# EAGLE design Ultra96toPMODV10 (EAGLE 9.6.2)
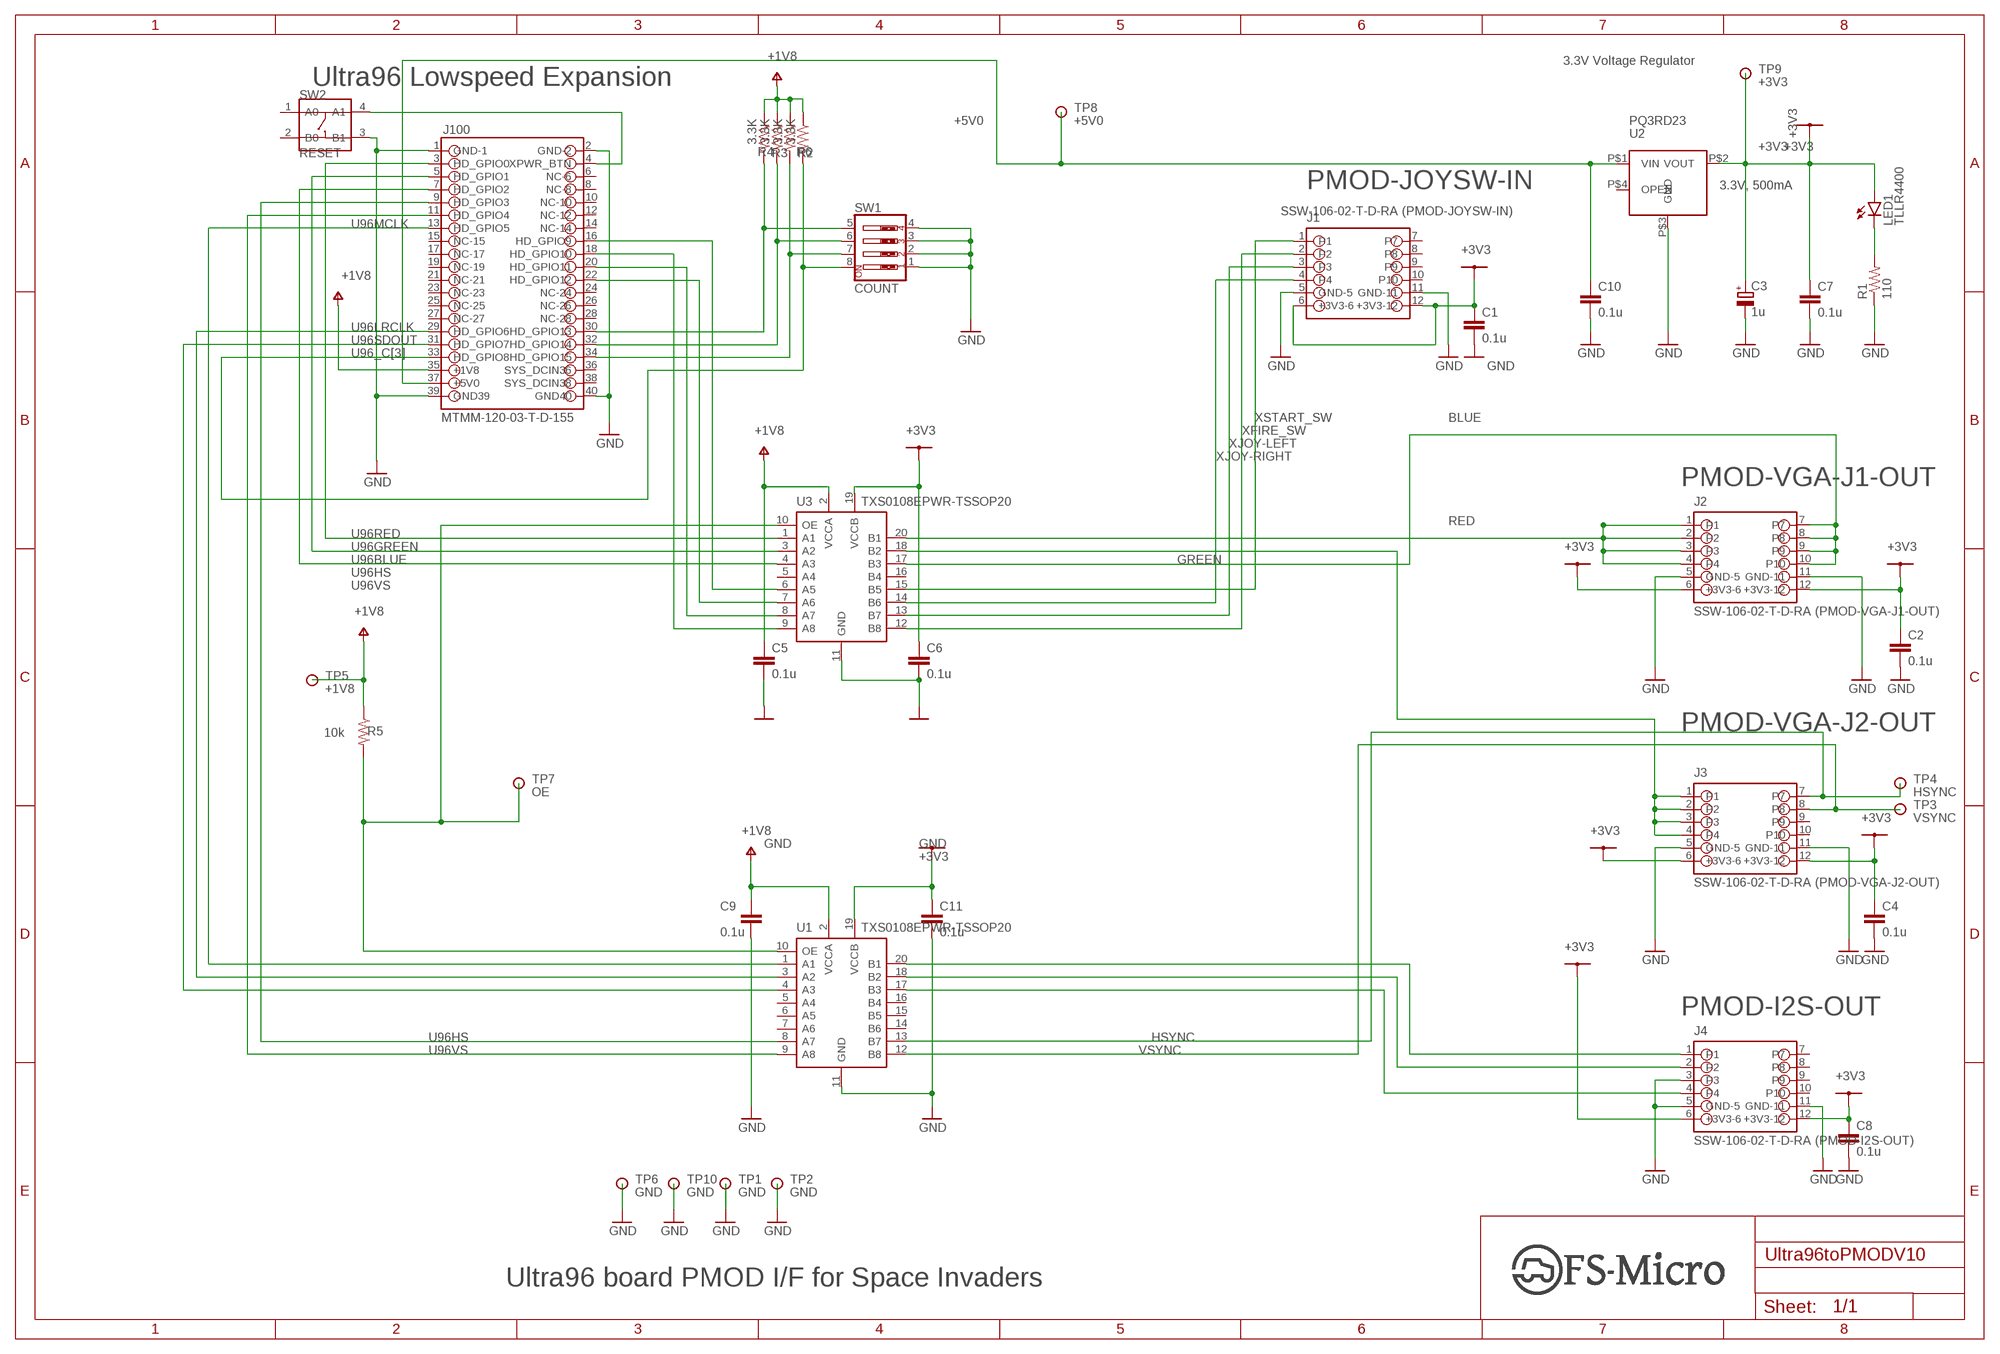
[diagram p0: schematic, sheet 1]

## Parts
C1  0.1u  C-EU050-025X075  [C050-025X075]
C2  0.1u  C-EU050-025X075  [C050-025X075]
C3  1u  CPOL-EUE2.5-5  [E2,5-5]
C4  0.1u  C-EU050-025X075  [C050-025X075]
C5  0.1u  C-EU050-025X075  [C050-025X075]
C6  0.1u  C-EU050-025X075  [C050-025X075]
C7  0.1u  C-EU050-025X075  [C050-025X075]
C8  0.1u  C-EU050-025X075  [C050-025X075]
C9  0.1u  C-EU050-025X075  [C050-025X075]
C10  0.1u  C-EU050-025X075  [C050-025X075]
C11  0.1u  C-EU050-025X075  [C050-025X075]
J1  SSW-106-02-T-D-RA (PMOD-JOYSW-IN)  SSW-106-02-T-D-RA  [SSW-106-02-T-D-RA]
J2  SSW-106-02-T-D-RA (PMOD-VGA-J1-OUT)  SSW-106-02-T-D-RA  [SSW-106-02-T-D-RA]
J3  SSW-106-02-T-D-RA (PMOD-VGA-J2-OUT)  SSW-106-02-T-D-RA  [SSW-106-02-T-D-RA]
J4  SSW-106-02-T-D-RA (PMOD-I2S-OUT)  SSW-106-02-T-D-RA  [SSW-106-02-T-D-RA]
J100  MTMM-120-03-T-D-155  [MTMM-120-03-T-D-155]
LED1  TLLR4400  [LED3MM]
R1  110  R-US_0207/10  [0207/10]
R2  3.3K  R-US_0207/10  [0207/10]
R3  3.3K  R-US_0207/10  [0207/10]
R4  3.3K  R-US_0207/10  [0207/10]
R5  10k  R-US_0207/10  [0207/10]
R6  3.3K  R-US_0207/10  [0207/10]
SW1  COUNT  SW_DIP-4  [EDG-04]
SW2  RESET  DIP-SWITCH-TACTILE-SPST-NO/TS-1109(4P-D6.0MM)'TS-1109'  [SW4-6.0X6.0X5.0MM]
TP1  GND  TP  [TP]
TP2  GND  TP  [TP]
TP3  VSYNC  TP  [TP]
TP4  HSYNC  TP  [TP]
TP5  +1V8  TP  [TP]
TP6  GND  TP  [TP]
TP7  OE  TP  [TP]
TP8  +5V0  TP  [TP]
TP9  +3V3  TP  [TP]
TP10  GND  TP  [TP]
U1  TXS0108EPWR-TSSOP20  LOGIC-TXS0108EPWR(TSSOP20)  [TSSOP20-0.65-6.5X4.4MM]
U2  PQ3RD23  [PQ3RD23]
U3  TXS0108EPWR-TSSOP20  LOGIC-TXS0108EPWR(TSSOP20)  [TSSOP20-0.65-6.5X4.4MM]

## Nets
+1V8 [+1V8]: C5.1 C9.1 J100.35(+1V8) R2.1 R3.1 R4.1 R5.1 R6.1 TP5.P$1 U1.2(VCCA) U3.2(VCCA)
+3V3 [+3V3]: C1.1 C2.1 C3.+ C4.1 C6.1 C7.1 C8.1 C11.1 J1.6(+3V3-6) J1.12(+3V3-12) J2.6(+3V3-6) J2.12(+3V3-12) J3.6(+3V3-6) J3.12(+3V3-12) J4.6(+3V3-6) J4.12(+3V3-12) LED1.A TP9.P$1 U1.19(VCCB) U2.P$2(VOUT) U3.19(VCCB)
+5V0 [+5V0]: C10.1 J100.37(+5V0) TP8.P$1 U2.P$1(VIN)
BLUE: J2.7 J2.8 J2.9 J2.10 U3.17(B3)
GND [GND]: C1.2 C2.2 C3.- C4.2 C5.2 C6.2 C7.2 C8.2 C9.2 C10.2 C11.2 J1.5(GND-5) J1.11(GND-11) J2.5(GND-5) J2.11(GND-11) J3.5(GND-5) J3.11(GND-11) J4.3 J4.5(GND-5) J4.11(GND-11) J100.1(GND-1) J100.2(GND-2) J100.39(GND39) J100.40(GND40) R1.1 SW1.1 SW1.2 SW1.3 SW1.4 SW2.3(B1) TP1.P$1 TP2.P$1 TP6.P$1 TP10.P$1 U1.11(GND) U2.P$3(GND) U3.11(GND)
GREEN: J3.1 J3.2 J3.3 J3.4 U3.18(B2)
HSYNC: J3.7 TP4.P$1 U1.13(B7)
LRCLK: J4.2 U1.18(B2)
MCLK: J4.1 U1.20(B1)
N$1: LED1.K(C) R1.2
OE: R5.2 TP7.P$1 U1.10(OE) U3.10(OE)
RED: J2.1 J2.2 J2.3 J2.4 U3.20(B1)
SDOUT: J4.4 U1.17(B3)
U96_C[0]: J100.30(HD_GPIO13) R4.2 SW1.5
U96_C[1]: J100.32(HD_GPIO14) R3.2 SW1.6
U96_C[2]: J100.34(HD_GPIO15) R2.2 SW1.7
U96_C[3]: J100.33(HD_GPIO8) R6.2 SW1.8
U96_FIRE: J100.18(HD_GPIO10) U3.9(A8)
U96_LEFT: J100.20(HD_GPIO11) U3.8(A7)
U96_RIGHT: J100.22(HD_GPIO12) U3.7(A6)
U96_START: J100.16(HD_GPIO9) U3.6(A5)
U96BLUE: J100.7(HD_GPIO2) U3.4(A3)
U96GREEN: J100.5(HD_GPIO1) U3.3(A2)
U96HS: J100.9(HD_GPIO3) U1.8(A7)
U96LRCLK: J100.29(HD_GPIO6) U1.3(A2)
U96MCLK: J100.13(HD_GPIO5) U1.1(A1)
U96RED: J100.3(HD_GPIO0) U3.1(A1)
U96SDOUT: J100.31(HD_GPIO7) U1.4(A3)
U96VS: J100.11(HD_GPIO4) U1.9(A8)
VSYNC: J3.8 TP3.P$1 U1.12(B8)
XFIRE_SW: J1.2 U3.12(B8)
XJOY-LEFT: J1.3 U3.13(B7)
XJOY-RIGHT: J1.4 U3.14(B6)
XPWR_BTN: J100.4(XPWR_BTN) SW2.4(A1)
XSTART_SW: J1.1 U3.15(B5)
Unconnected: J1.7 J1.8 J1.9 J1.10 J3.9 J3.10 J4.7 J4.8 J4.9 J4.10 J100.6(NC-6) J100.8(NC-8) J100.10(NC-10) J100.12(NC-12) J100.14(NC-14) J100.15(NC-15) J100.17(NC-17) J100.19(NC-19) J100.21(NC-21) J100.23(NC-23) J100.24(NC-24) J100.25(NC-25) J100.26(NC-26) J100.27(NC-27) J100.28(NC-28) J100.36(SYS_DCIN36) J100.38(SYS_DCIN38) SW2.1(A0) SW2.2(B0) U1.5(A4) U1.6(A5) U1.7(A6) U1.14(B6) U1.15(B5) U1.16(B4) U2.P$4(OPEN) U3.5(A4) U3.16(B4)

## Notes on the sheet
- 3.3V Voltage Regulator
- Ultra96 Lowspeed Expansion
- PMOD-JOYSW-IN | 3.3V, 500mA
- PMOD-VGA-J1-OUT
- PMOD-VGA-J2-OUT
- PMOD-I2S-OUT
- Ultra96 board PMOD I/F for Space Invaders

## Library data of the parts
C1 C2 C4-C11 = rcl:C-EU: CAPACITOR, European symbol; SPICEPREFIX: C
C3 = rcl:CPOL-EU: POLARIZED CAPACITOR, European symbol; SPICEPREFIX: C
J1-J4 = mylib:SSW-106-02-T-D-RA; VALUES: >VALUE
J100 = mylib:MTMM-120-03-T-D-155
LED1 = led:TLLR4400: Low Current (2mA) LED 3 mm Tinted Diffused Package color RED Source: Data sheet <http://www.farnell.com/datasheets/391100.pdf>; MF: VISHAY SEMICONDUCTOR; OC_FARNELL: 1612437
R1-R6 = rcl:R-US_: RESISTOR, American symbol; SPICEPREFIX: R
SW1 = special:SW_DIP-4: DIP SWITCH
SW2 = Seeed-Switch:DIP-SWITCH-TACTILE-SPST-NO/TS-1109(4P-D6.0MM): 311020024
TP1-TP10 = mylib:TP
U1 U3 = Seeed-IC:LOGIC-TXS0108EPWR(TSSOP20): 310050026; MPN: TXS0108EPWR
U2 = mylib:PQ3RD23

## Net classes
0 default: width 0.152 mm, drill 0.254 mm, clearance 0.152 mm
1 GND: width 0.508 mm, drill 0.254 mm, clearance 0.152 mm
2 +5V0: width 0.508 mm, drill 0.254 mm, clearance 0.152 mm
3 +3V3: width 0.508 mm, drill 0.254 mm, clearance 0.152 mm
4 +1V8: width 0.508 mm, drill 0.254 mm, clearance 0.152 mm

## Board
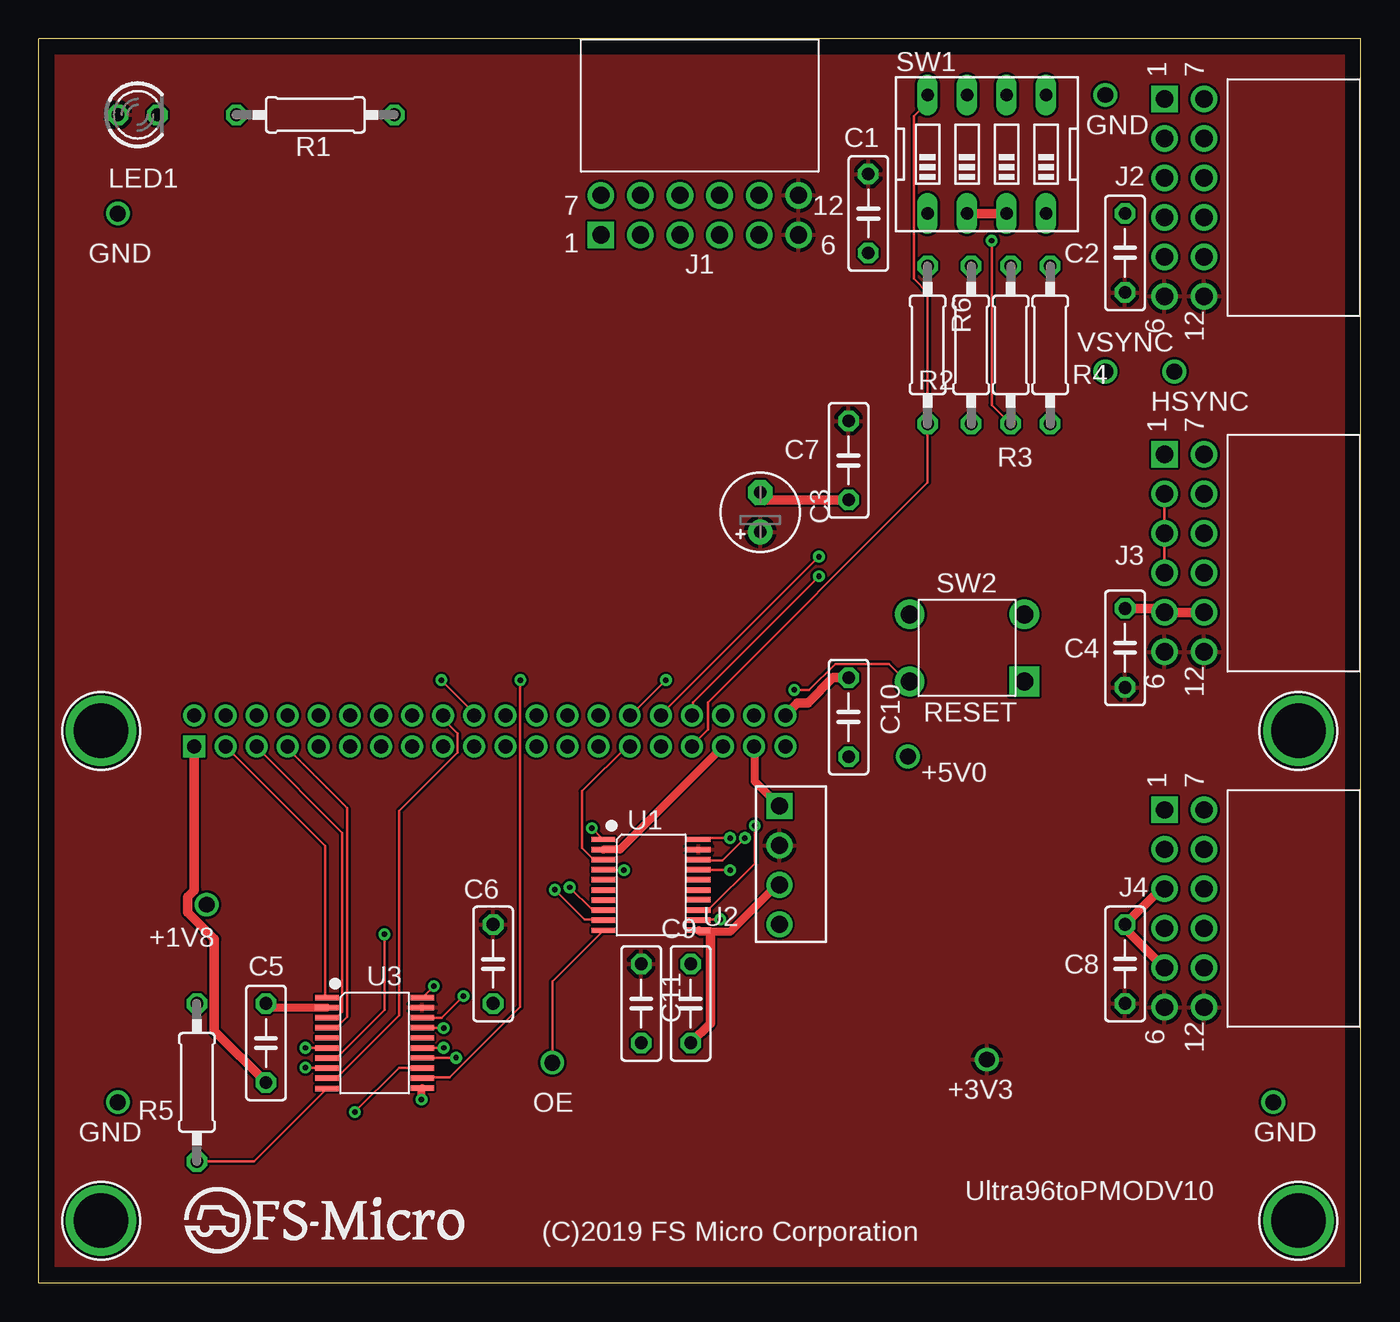
[diagram p1: board, top side]
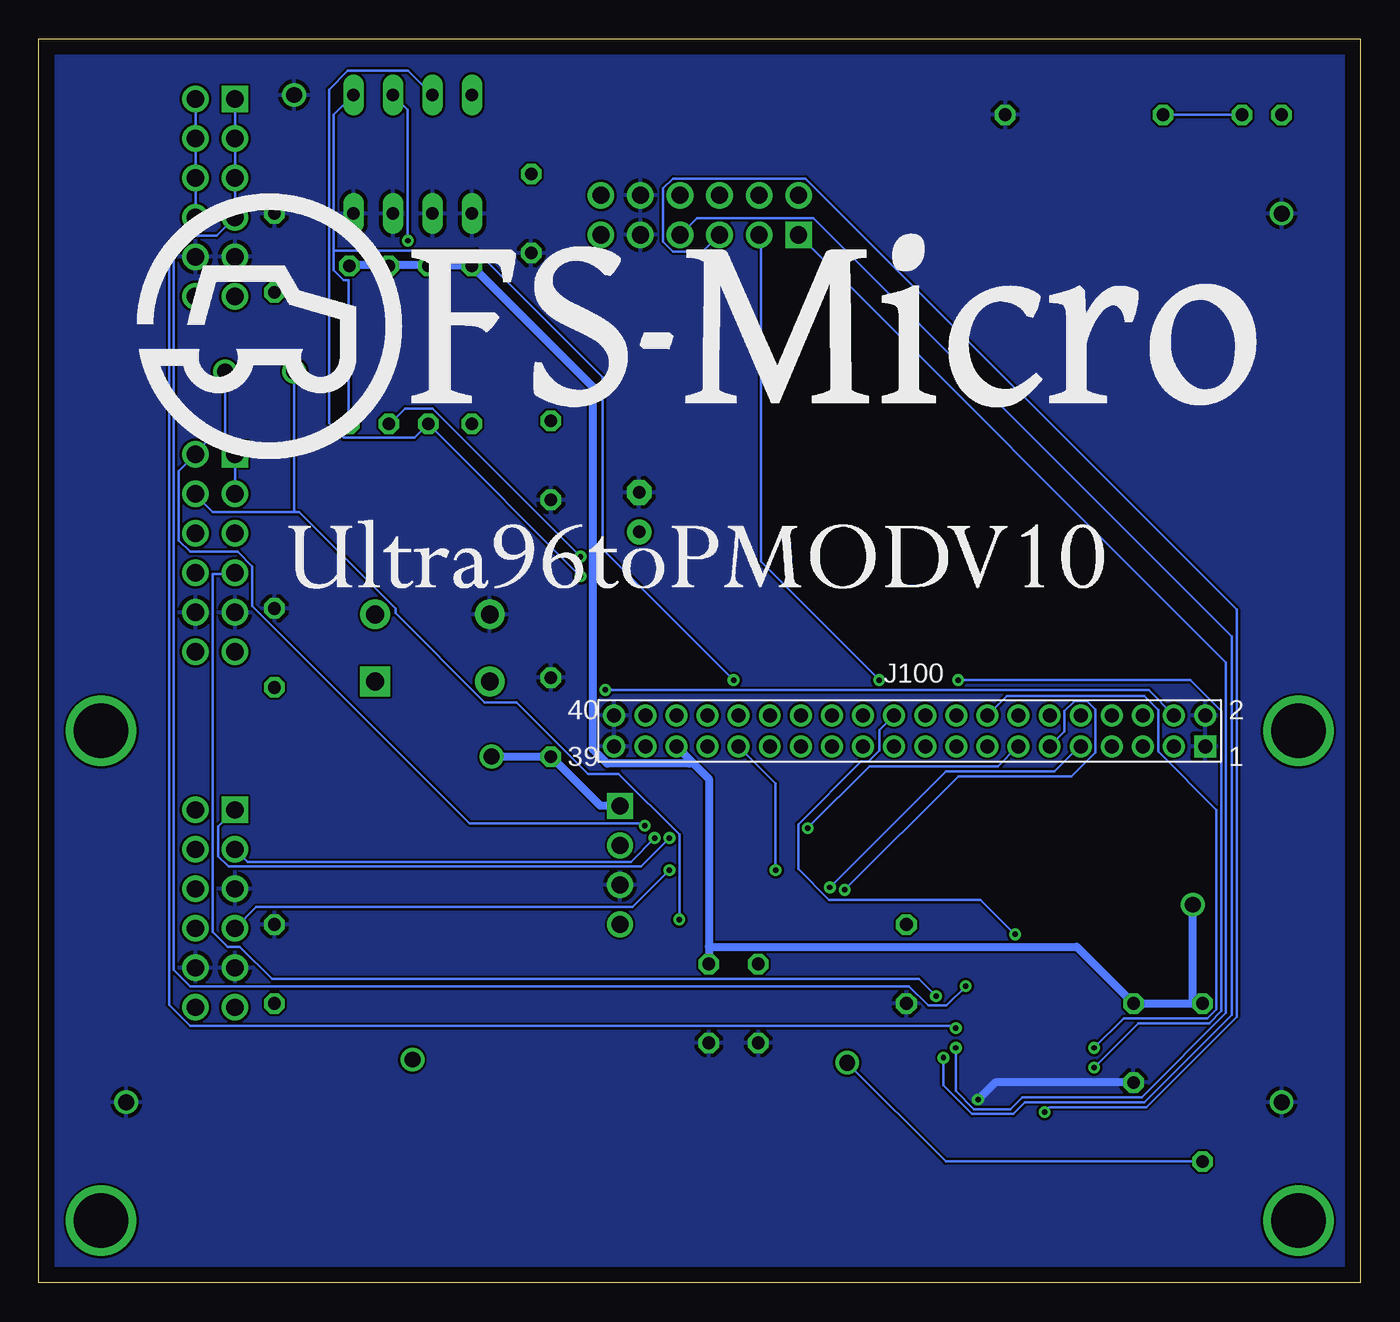
[diagram p2: board, bottom side, seen from below]

Size 85 x 80 mm. Coordinates in mm from the lower left corner, seen from the top.
Outline: 85,0 85,80 0,80 0,0 85,0
Copper layers (1+16): Top 0.035mm / dielectric 0.2mm / Bottom 0.035mm
Design rules "default *": minimum track width 6mil, minimum drill 0.35mm, track to track 6mil, track to pad 6mil, pad to pad 6mil, via to via 6mil, smd to smd 6mil, copper to edge 40mil, drill to drill 6mil, minimum pad ring 10mil, minimum via ring 8mil, stop-mask expansion 4mil, vias tented up to drill 0mil, thermal gap 10mil

### Footprints (pad centres in the part's own frame; a part is rotated, then mirrored left to right if it is on the bottom)
C050-025X075 = drill 0.813 octagon: 1 -2.54,0; 2 2.54,0
E2,5-5 = drill 0.813 pad 1.6: + -1.27,0 | drill 0.813 pad 1.6 octagon: - 1.27,0
SSW-106-02-T-D-RA = drill 1.105 pad 1.705 square: 1 6.35,1.27 | drill 1.105 pad 1.705: 2 3.81,1.27; 3 1.27,1.27; 4 -1.27,1.27; 5 -3.81,1.27; 6 -6.35,1.27; 7 6.35,-1.27; 8 3.81,-1.27; 9 1.27,-1.27; 10 -1.27,-1.27; 11 -3.81,-1.27; 12 -6.35,-1.27
MTMM-120-03-T-D-155 = drill 0.9 square: 1 -19,1 | drill 0.9: 2 -19,-1; 3 -17,1; 4 -17,-1; 5 -15,1; 6 -15,-1; 7 -13,1; 8 -13,-1; 9 -11,1; 10 -11,-1; 11 -9,1; 12 -9,-1; 13 -7,1; 14 -7,-1; 15 -5,1; 16 -5,-1; 17 -3,1; 18 -3,-1; 19 -1,1; 20 -1,-1; 21 1,1; 22 1,-1; 23 3,1; 24 3,-1; 25 5,1; 26 5,-1; 27 7,1; 28 7,-1; 29 9,1; 30 9,-1; 31 11,1; 32 11,-1; 33 13,1; 34 13,-1; 35 15,1; 36 15,-1; 37 17,1; 38 17,-1; 39 19,1; 40 19,-1
LED3MM = drill 0.813 octagon: A -1.27,0; K 1.27,0
0207/10 = drill 0.813 octagon: 1 -5.08,0; 2 5.08,0
EDG-04 = drill 0.813 long: 1 -3.81,-3.81; 2 -1.27,-3.81; 3 1.27,-3.81; 4 3.81,-3.81; 5 3.81,3.81; 6 1.27,3.81; 7 -1.27,3.81; 8 -3.81,3.81
SW4-6.0X6.0X5.0MM = drill 1.143 pad 1.905 square: 1 -3.683,2.159 | drill 1.143 pad 1.905: 2 -3.683,-2.159; 3 3.683,-2.159; 4 3.683,2.159
TP = drill 1.02: P$1 0,0
TSSOP20-0.65-6.5X4.4MM = smd 0.35 x 1.5: 1 -2.925,-3.065; 2 -2.275,-3.065; 3 -1.625,-3.065; 4 -0.975,-3.065; 5 -0.325,-3.065; 6 0.325,-3.065; 7 0.975,-3.065; 8 1.625,-3.065; 9 2.275,-3.065; 10 2.925,-3.065; 11 2.91,3.065; 12 2.26,3.065; 13 1.61,3.065; 14 0.96,3.065; 15 0.325,3.065; 16 -0.325,3.065; 17 -0.975,3.065; 18 -1.625,3.065; 19 -2.275,3.065; 20 -2.925,3.065
PQ3RD23 = drill 1.1 square: P$1 0,0 | drill 1.1: P$2 2.54,0; P$3 5.08,0; P$4 7.62,0

### Placement (x,y rotation side)
C1  53.34,68.77 270 top
C2  69.85,66.23 90 top
C3  46.39,49.56 90 top
C4  69.85,40.83 90 top
C5  14.61,15.43 270 top
C6  29.21,20.51 270 top
C7  52.07,52.9 270 top
C8  69.85,20.51 90 top
C9  41.91,17.97 270 top
C10  52.07,36.38 90 top
C11  38.73,17.97 270 top
J1  42.5,68.67 180 top
J2  73.66,69.79 90 top
J3  73.66,46.93 90 top
J4  73.66,24.07 90 top
J100  29,35.5 180 bottom
LED1  6.35,75.12 0 top
R1  17.78,75.12 180 top
R2  59.96,60.32 270 top
R3  62.5,60.32 270 top
R4  65.04,60.32 270 top
R5  10.16,12.89 270 top
R6  57.15,60.32 270 top
SW1  60.96,72.58 0 top
SW2  59.69,40.83 180 top
TP1  5.08,68.77 0 top
TP2  68.58,76.39 0 top
TP3  68.58,58.61 0 top
TP4  73.03,58.61 0 top
TP5  10.79,24.32 0 top
TP6  5.08,11.62 0 top
TP7  33.02,14.16 0 top
TP8  55.88,33.84 0 top
TP9  60.97,14.36 0 top
TP10  79.38,11.62 0 top
U1  39.37,25.59 270 top
U2  47.62,30.67 270 top
U3  21.59,15.43 270 top
U$1  [REVERSELOGO]  6.68,53.01 0 top
U$2  [REVERSE_V10]  16.51,44.64 0 top
U$3  [SMALL-LOGO]  9.36,1.9 0 top

### Tracks (layer width: path | path; a pad name or v marks a point on that pad's centre or on a via)
+1V8
  Top 0.508: U1.2 37.37,27.86 J100.35 | C5.1 14.87,17.7 U3.2
  Bottom 0.508: TP5.P$1 10.79,18.13 R5.1 C5.1 18.26,21.62 41.91,21.62 | R4.1 64.93,65.44 62.71,65.44 R3.1 62.39,65.44 60.17,65.44 R2.1 59.85,65.44 57.15,65.44 R6.1 49.37,57.62 49.37,34.3 48.46,33.39 43.16,33.39 43.02,33.53 | 41.91,21.62 C9.1 | 43.02,33.53 43.97,34.48 J100.35 | 41.91,21.62 41.91,32.42 43.02,33.53
+3V3
  pour Top: 0,80.2 0,0.19 85.09,0.19 85.09,80.2
+5V0
  Top 0.508: U2.P$1 46.04,32.26 46.04,34.46 J100.37
  Bottom 0.508: TP8.P$1 C10.1 48.9,30.67 U2.P$1
BLUE  (via drill 0.35)
  Top 0.152: v26.04,16.38 24.77,16.38 U3.17
  Bottom 0.152: J2.7 J2.8 J2.9 J2.10 76.62,66.83 76.62,17.88 75.28,16.54 26.19,16.54 v26.04,16.38
GND  (via drill 0.35)
  Top 0.508: v24.61,11.78 24.61,12.41 U3.11 | U2.P$3 47.47,25.59 44.45,22.57 43.18,22.57 42.55,22.57 U1.11
  Top 0.61: C9.2 43.18,16.7 43.18,22.57 | J100.40 48.8,37.3 49.45,37.3 51.08,38.92 C10.2 | J100.1 10,25.25 9.57,24.83 9.57,23.81 11.28,22.11 11.28,16.22 C5.2 | SW1.3 SW1.2 | J4.5 69.85,22.8 C8.2 72.14,25.34 J4.3 | J3.11 J3.5 72.14,43.37 C4.2 | C7.2 46.87,50.35 C3.-
  Bottom 0.508: v24.61,11.78 23.5,12.89 C5.2
  pour Bottom: 0,80.2 0,0.19 85.09,0.19 85.09,80.2
GREEN  (via drill 0.35)
  Top 0.152: J3.2 J3.3 J3.4 | v27.3,18.45 25.91,17.05 U3.18
  Bottom 0.152: J3.2 J3.1 | v27.3,18.45 28.42,19.56 70.01,19.56 72.07,21.62 72.87,21.62 73.82,22.57 73.82,45.59 72.39,45.59 J3.4
HSYNC  (via drill 0.35)
  Top 0.152: U1.13 42.46,24 43.06,24 46.04,26.98 v46.04,29.4
  Bottom 0.152: v46.04,29.4 46.2,29.56 57.3,29.56 71.28,43.54 71.28,46.08 72.22,47.02 75.28,47.02 76.01,47.75 76.01,52.2 J3.7 74.93,53.37 73.82,54.48 73.03,54.48 TP4.P$1
LRCLK  (via drill 0.35)
  Top 0.152: v45.4,28.61 43.97,27.18 42.55,27.18 U1.18
  Bottom 0.152: J4.2 71.59,27.08 46.93,27.08 v45.4,28.61
MCLK  (via drill 0.35)
  Top 0.152: v44.45,28.61 42.55,28.61 U1.20
  Bottom 0.152: J4.1 73.47,29.34 73.47,27.43 72.81,26.77 46.28,26.77 v44.45,28.61
N$1
  Bottom 0.152: R1.2 LED1.K
N$23  (via drill 3.5 pad 4)
  other vias: 4,4
N$26  (via drill 3.5 pad 4)
  other vias: 81,4
N$27  (via drill 3.5 pad 4)
  other vias: 4,35.5
N$28  (via drill 3.5 pad 4)
  other vias: 81,35.5
OE
  Top 0.152: R5.2 13.83,7.81 U3.10 | TP7.P$1 33.02,19.38 U1.10
  Bottom 0.152: TP7.P$1 26.67,7.81 R5.2
RED  (via drill 0.35)
  Top 0.152: v25.4,19.08 24.77,18.45 U3.20
  Bottom 0.152: J2.1 J2.2 J2.3 J2.4 73.57,67.34 75.1,67.34 76.32,66.12 76.32,20.12 75.28,19.08 29.05,19.08 27.81,17.84 26.64,17.84 v25.4,19.08
SDOUT  (via drill 0.35)
  Top 0.152: v44.45,26.54 42.55,26.54 U1.17
  Bottom 0.152: v44.45,26.54 46.83,24.16 71.03,24.16 J4.4
U96_C[0]  (via drill 0.35)
  Top 0.152: v40.32,38.77 38.1,36.54 J100.30
  Bottom 0.152: 66.04,66.39 66.04,65.12 65.41,64.48 65.09,64.48 65.09,55.28 R4.2 | v40.32,38.77 48.74,47.18 48.74,58.24 56.88,66.39 66.04,66.39 | SW1.5 66.04,75.12 66.04,66.39
U96_C[1]  (via drill 0.35)
  Top 0.152: v50.16,46.7 40,36.54 J100.32 | v61.28,67.02 61.28,56.46 R3.2
  Bottom 0.152: v50.16,46.7 59.69,56.23 61.44,56.23 62.39,55.28 R3.2 | SW1.6 61.28,75.44 v61.28,67.02
U96_C[2]  (via drill 0.35)
  Top 0.152: v50.16,45.43 42.07,37.34 42.07,36.57 J100.34
  Bottom 0.152: v50.16,45.43 59.85,55.12 R2.2 60.85,54.35 65.41,54.35 66.34,55.29 66.34,76.73 65.14,77.94 61.24,77.94 SW1.7
U96_C[3]
  Top 0.152: SW1.8 57.15,75.91 56.26,75.03 56.26,64.58 57.15,63.69 R6.2 57.15,51.47 43.02,37.34 43.02,35.59 42,34.57 J100.33
U96_FIRE
  Top 0.152: J100.18 26,36.26 26.93,35.33 26.93,34.11 23.18,30.35 23.18,17.21 19.18,13.21 18.58,13.21 U3.9
U96_LEFT  (via drill 0.35)
  Top 0.152: v17.14,13.84 18.41,13.84 U3.8 | v25.88,38.77 28.1,36.54 J100.20
  Bottom 0.152: v17.14,13.84 14.29,16.7 9.74,16.7 8.97,17.48 8.97,36.78 10.95,38.77 v25.88,38.77
U96_RIGHT  (via drill 0.35)
  Top 0.152: U3.7 18.55,14.48 19.15,14.48 22.23,17.56 v22.23,22.41
  Bottom 0.152: v22.23,22.41 24.45,24.64 34.2,24.64 36.17,26.61 36.17,29.49 32.13,33.53 31.65,33.53 30.96,34.23 30.96,35.54 J100.22
U96_START  (via drill 0.35)
  Top 0.152: v17.14,15.11 18.41,15.11 U3.6
  Bottom 0.152: v17.14,15.11 15.24,17.02 9.86,17.02 9.27,17.6 9.27,30.42 13.02,34.16 13.02,36.84 13.92,37.74 22.76,37.74 J100.16
U96BLUE
  Top 0.152: J100.7 16,34.36 19.81,30.55 19.81,17.09 19.26,16.54 18.66,16.54 U3.4
U96GREEN
  Top 0.152: J100.5 14,34.45 19.5,28.95 19.5,17.44 19.12,17.05 U3.3
U96HS  (via drill 0.35)
  Top 0.152: v34.13,25.43 35.56,24 36.2,24 U1.8
  Bottom 0.152: v34.13,25.43 26.67,32.89 19.68,32.89 18.08,34.5 J100.9
U96LRCLK
  Top 0.152: U1.3 36.2,27.18 35.72,27.18 34.92,27.97 34.92,31.62 37.94,34.64 J100.29
U96MCLK  (via drill 0.35)
  Top 0.152: v35.56,29.24 36.2,28.61 U1.1
  Bottom 0.152: v35.56,29.24 31.59,33.21 23.34,33.21 22.07,34.48 J100.13
U96RED
  Top 0.152: U3.1 18.41,18.46 18.41,28.09 J100.3
U96SDOUT  (via drill 0.35)
  Top 0.152: v37.62,26.54 36.35,26.54 U1.4
  Bottom 0.152: J100.31 37.62,32.12 v37.62,26.54
U96VS  (via drill 0.35)
  Top 0.152: v33.18,25.27 35.08,23.37 36.2,23.37 U1.9
  Bottom 0.152: v33.18,25.27 25.88,32.58 18.61,32.58 17.07,34.11 17.07,36.89 17.61,37.43 18.39,37.43 19.05,36.77 19.05,35.45 J100.11
VSYNC  (via drill 0.35)
  Top 0.152: v43.81,23.37 42.55,23.37 U1.12
  Bottom 0.152: 68.58,49.56 73.82,49.56 74.93,50.67 J3.8 | 68.58,49.56 TP3.P$1 | 68.58,49.56 68.28,49.56 62.07,43.36 62.07,43.06 56.34,37.34 54.29,37.34 49.69,32.73 47.72,32.73 43.81,28.83 v43.81,23.37
XFIRE_SW  (via drill 0.35)
  Top 0.152: U3.12 24.69,13.21 26.42,13.21 30.96,17.75 v30.96,38.77
  Bottom 0.152: v30.96,38.77 38.58,46.39 38.58,67.28 J1.2
XJOY-LEFT  (via drill 0.35)
  Top 0.152: v20.32,10.98 23.16,13.82 U3.13
  Bottom 0.152: v20.32,10.98 20,11.3 13.79,11.3 7.98,17.12 7.98,43.29 35.7,71.02 44.22,71.02 44.85,70.39 44.85,66.95 44.22,66.32 42.31,66.32 J1.3
XJOY-RIGHT  (via drill 0.35)
  Top 0.152: v26.83,14.48 24.77,14.48 U3.14
  Bottom 0.152: J1.4 43.76,67.4 42.68,68.48 35.2,68.48 8.28,41.56 8.28,17.24 13.9,11.62 21.59,11.62 22.34,10.87 24.98,10.87 26.83,12.71 v26.83,14.48
XPWR_BTN  (via drill 0.35)
  Top 0.152: v48.58,38.13 49.53,38.13 51.21,39.81 54.67,39.81 55.82,38.67 SW2.4
  Bottom 0.152: v48.58,38.13 13.63,38.13 J100.4
XSTART_SW  (via drill 0.35)
  Top 0.152: v26.04,15.11 24.77,15.11 U3.15
  Bottom 0.152: v26.04,15.11 26.04,12.35 24.86,11.17 22.51,11.17 21.75,11.94 14.07,11.94 8.66,17.35 8.66,39.91 J1.1

### Text on the board
tNames: RESET | (C)2019 FS Micro Corporation